# EAGLE board L4V2-5 (EAGLE 8.7.0)
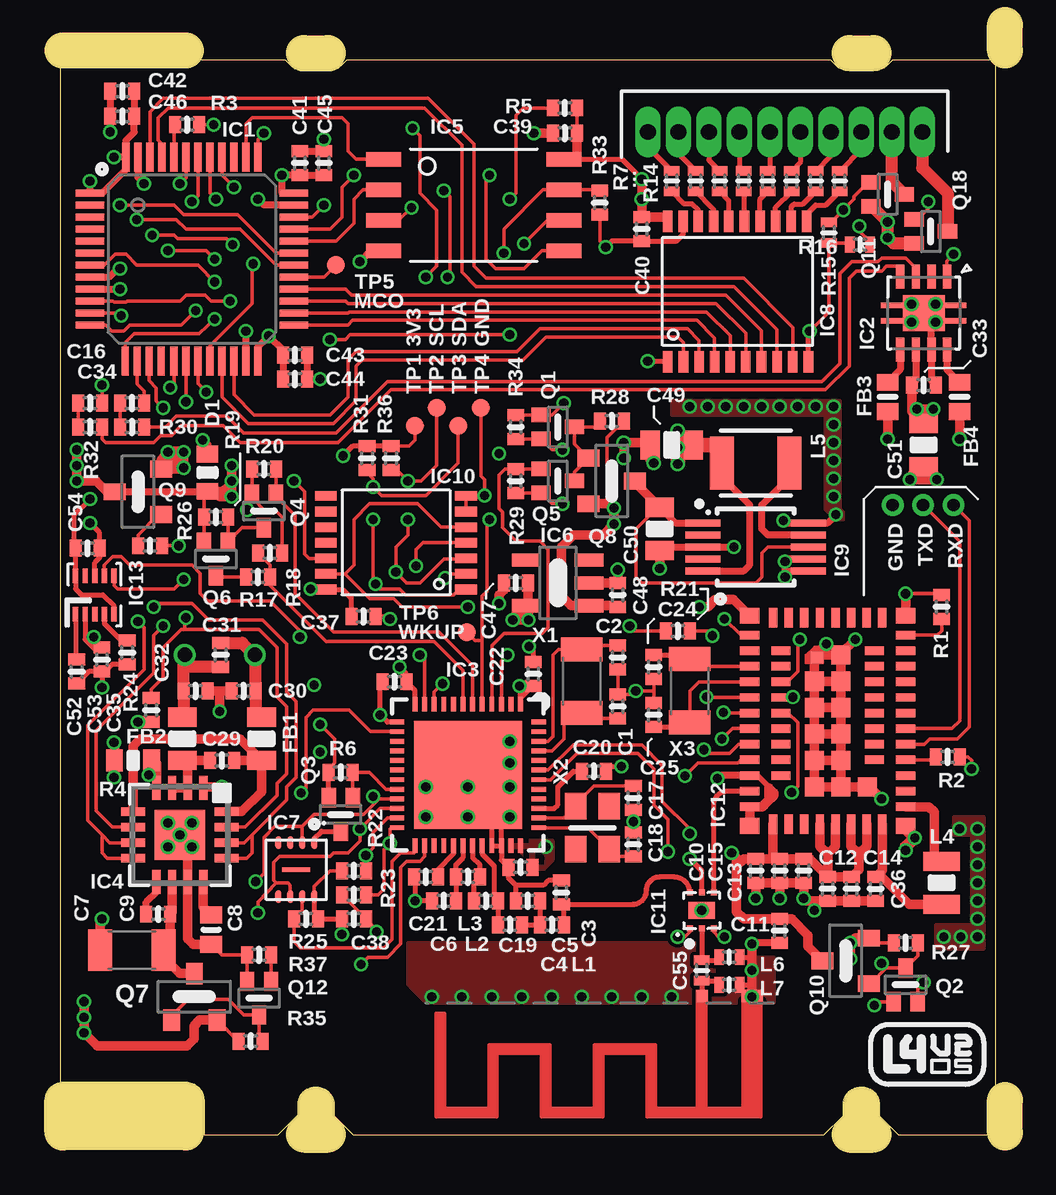
[diagram p4: board, top side]
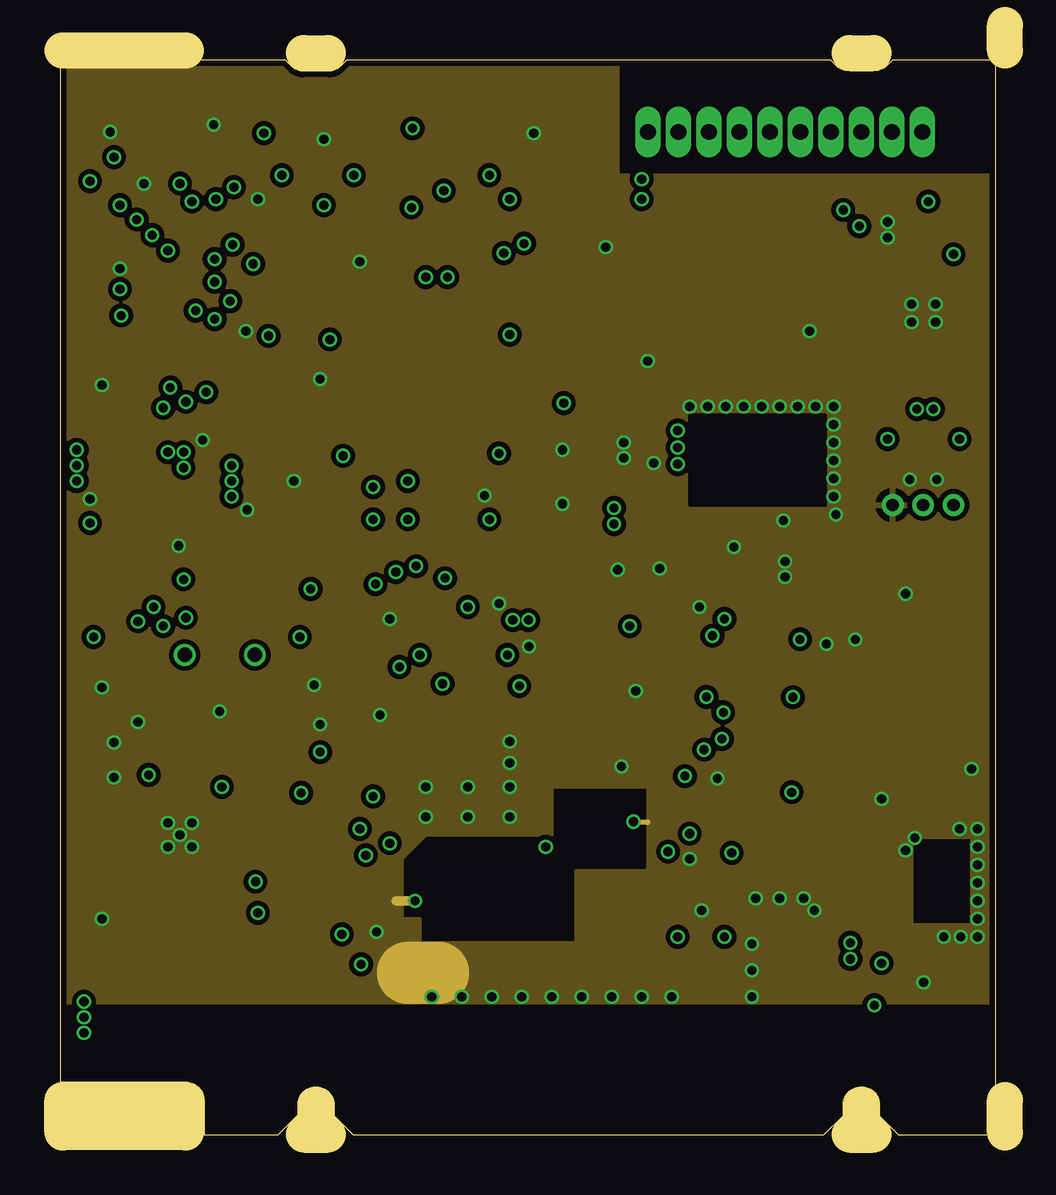
[diagram p5: board, inner layer GND]
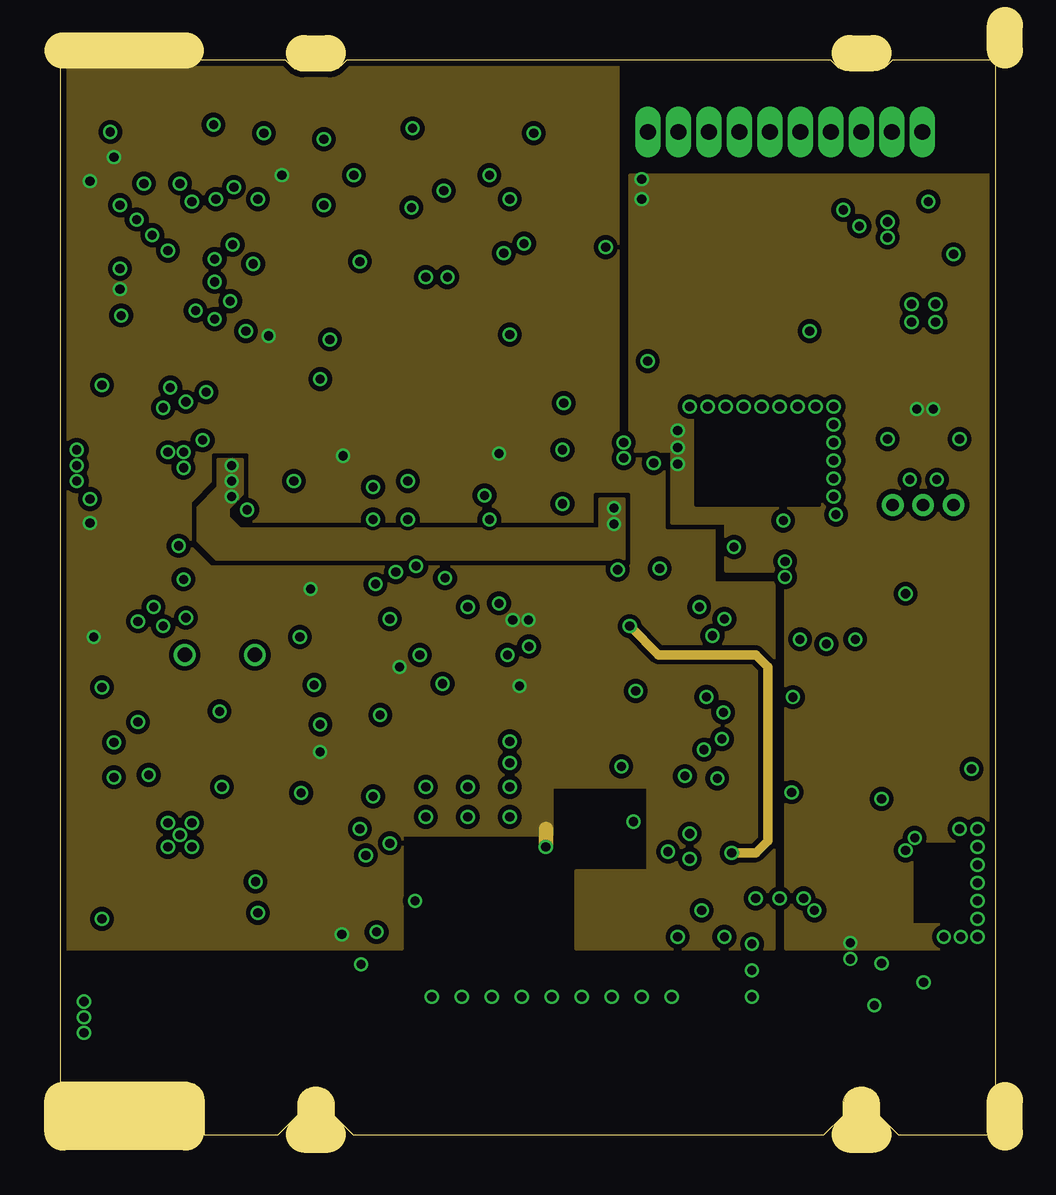
[diagram p6: board, inner layer Power]
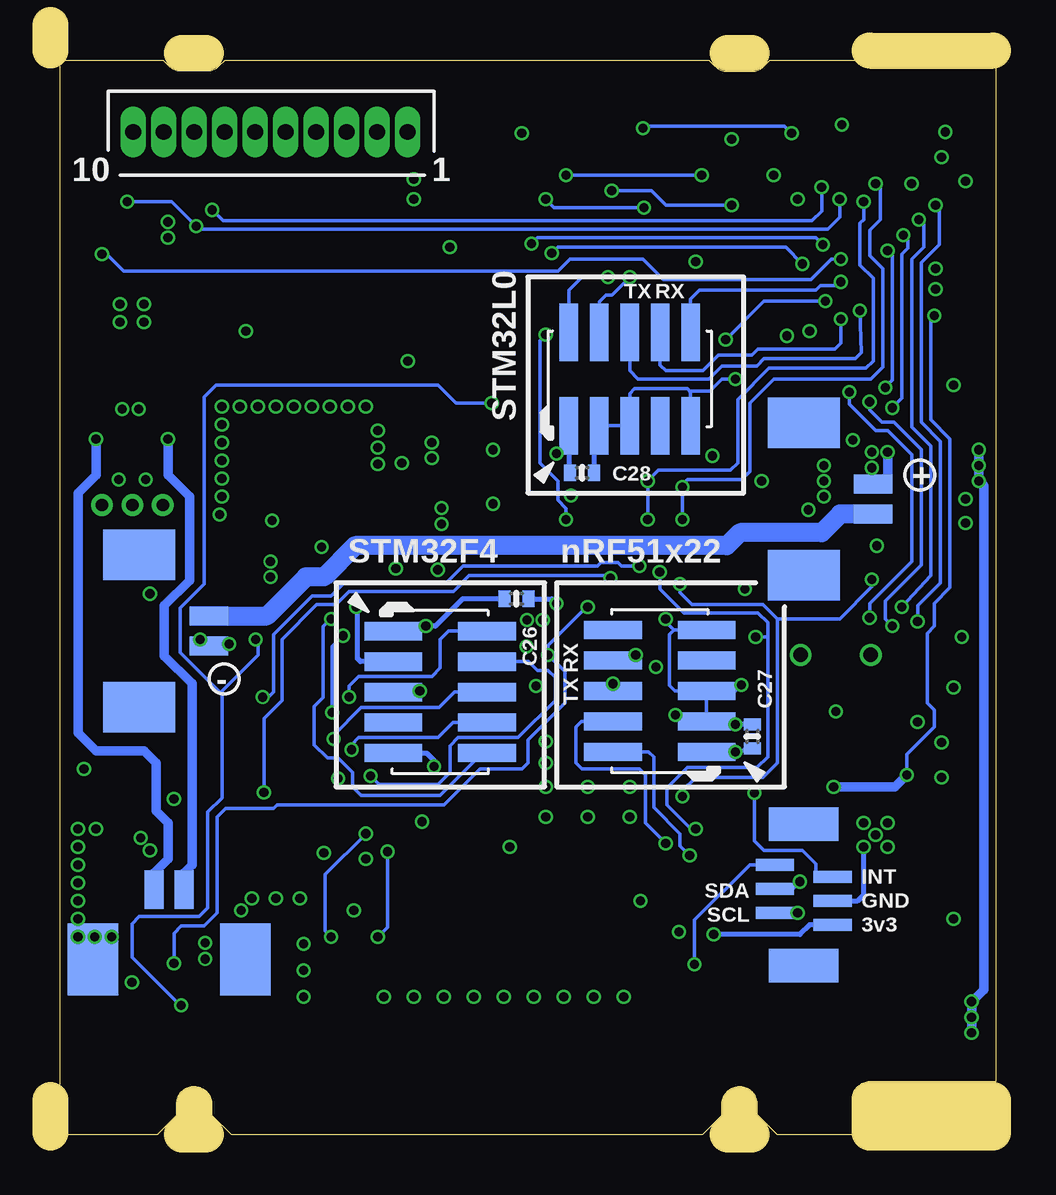
[diagram p7: board, bottom side, seen from below]

Size 39 x 44.8 mm. Coordinates in mm from the lower left corner, seen from the top.
Copper layers (1*2*15*16): Top 0.035mm / dielectric 0.2mm / GND 0.018mm / dielectric 1.2mm / Power 0.018mm / dielectric 0.2mm / Bottom 0.035mm
Design rules "default *": minimum track width 6mil, minimum drill 10mil, track to track 6mil, track to pad 6mil, pad to pad 6mil, via to via 8mil, smd to smd 0mil, copper to edge 10mil, drill to drill 10mil, minimum pad ring 6mil, minimum via ring 4mil, stop-mask expansion 4mil, vias tented up to drill 20mil, thermal gap 10mil

## Footprints (pad centres in the part's own frame; a part is rotated, then mirrored left to right if it is on the bottom)
ANTENNA-2.450GHZ-TI-AN043 = smd 0.5 x 0.5: ANT 0,0 | smd 0.9 x 0.5: RFGND -2.1,0
0402 = smd 0.5 x 0.7: 1 -0.5,0; 2 0.5,0
1206-MIN = smd 1 x 1.727: 1 -1.323,0; 2 1.323,0
0603-MIN = smd 0.7 x 0.9: 1 -0.61,0; 2 0.61,0
0805-MIN = smd 0.8 x 1.2: 1 -0.9,0; 2 0.9,0
0402-MIN = smd 0.4 x 0.65: 1 -0.425,0; 2 0.425,0
0603 = smd 0.7 x 0.9: 1 -0.777,0; 2 0.777,0
LQFP48-0.5MM = smd 1.2 x 0.297: 1 -4.25,2.75; 2 -4.25,2.25; 3 -4.25,1.75; 4 -4.25,1.25; 5 -4.25,0.75; 6 -4.25,0.25; 7 -4.25,-0.25; 8 -4.25,-0.75; 9 -4.25,-1.25; 10 -4.25,-1.75; 11 -4.25,-2.25; 12 -4.25,-2.75; 25 4.25,-2.75; 26 4.25,-2.25; 27 4.25,-1.75; 28 4.25,-1.25; 29 4.25,-0.75; 30 4.25,-0.25; 31 4.25,0.25; 32 4.25,0.75; 33 4.25,1.25; 34 4.25,1.75; 35 4.25,2.25; 36 4.25,2.75 | smd 0.297 x 1.2: 13 -2.78,-4.25; 14 -2.28,-4.25; 15 -1.78,-4.25; 16 -1.28,-4.25; 17 -0.75,-4.25; 18 -0.25,-4.25; 19 0.25,-4.25; 20 0.75,-4.25; 21 1.25,-4.25; 22 1.75,-4.25; 23 2.25,-4.25; 24 2.75,-4.25; 37 2.75,4.25; 38 2.25,4.25; 39 1.75,4.25; 40 1.25,4.25; 41 0.75,4.25; 42 0.25,4.25; 43 -0.25,4.25; 44 -0.75,4.25; 45 -1.25,4.25; 46 -1.75,4.25; 47 -2.25,4.25; 48 -2.75,4.25
QFN8-3X3MM-TI-TPA200X-BETTER-STENCIL = smd 0.35 x 1: 1 0.975,1.525; 2 0.325,1.525; 3 -0.325,1.525; 4 -0.975,1.525; 5 -0.975,-1.525; 6 -0.325,-1.525; 7 0.325,-1.525; 8 0.975,-1.525 | smd 1.75 x 1.5: BODY1 0,0 | smd 0.9 x 0.23: BODY2 -1.325,0.325; BODY3 -1.325,-0.325; BODY4 1.325,-0.325; BODY5 1.325,0.325
QFN48-5X5MM-0.4MM = smd 0.6 x 0.203: 1 -2.95,2.2; 2 -2.95,1.8; 3 -2.95,1.4; 4 -2.95,1; 5 -2.95,0.6; 6 -2.95,0.2; 7 -2.95,-0.2; 8 -2.95,-0.6; 9 -2.95,-1; 10 -2.95,-1.4; 11 -2.95,-1.8; 12 -2.95,-2.2; 25 2.95,-2.2; 26 2.95,-1.8; 27 2.95,-1.4; 28 2.95,-1; 29 2.95,-0.6; 30 2.95,-0.2; 31 2.95,0.2; 32 2.95,0.6; 33 2.95,1; 34 2.95,1.4; 35 2.95,1.8; 36 2.95,2.2 | smd 0.203 x 0.6: 13 -2.2,-2.95; 14 -1.8,-2.95; 15 -1.4,-2.95; 16 -1,-2.95; 17 -0.6,-2.95; 18 -0.2,-2.95; 19 0.2,-2.95; 20 0.6,-2.95; 21 1,-2.95; 22 1.4,-2.95; 23 1.8,-2.95; 24 2.2,-2.95; 37 2.2,2.95; 38 1.8,2.95; 39 1.4,2.95; 40 1,2.95; 41 0.6,2.95; 42 0.2,2.95; 43 -0.2,2.95; 44 -0.6,2.95; 45 -1,2.95; 46 -1.4,2.95; 47 -1.8,2.95; 48 -2.2,2.95 | smd 4.5 x 4.5: EP 0,0
QFN16-4X4MM-0.65MM = smd 1 x 0.35: 1 -1.95,0.975; 2 -1.95,0.325; 3 -1.95,-0.325; 4 -1.95,-0.975; 9 1.95,-0.975; 10 1.95,-0.325; 11 1.95,0.325; 12 1.95,0.975 | smd 0.35 x 1: 5 -0.975,-1.95; 6 -0.325,-1.95; 7 0.325,-1.95; 8 0.975,-1.95; 13 0.975,1.95; 14 0.325,1.95; 15 -0.325,1.95; 16 -0.975,1.95 | smd 2.1 x 2.1: PAD 0,0
SOIC8-5.3MM-MINIMAL = smd 1.473 x 0.61: 1 -3.763,1.905; 2 -3.763,0.635; 3 -3.763,-0.635; 4 -3.763,-1.905; 5 3.763,-1.905; 6 3.763,-0.635; 7 3.763,0.635; 8 3.763,1.905
SOT23-5 = smd 0.55 x 1.2: 1 0.95,1.3; 2 0,1.3; 3 -0.95,1.3; 4 -0.95,-1.3; 5 0.95,-1.3
DFN8-2.5MMX2.5MM = smd 0.525 x 0.25: 1 -1.125,0.75; 2 -1.125,0.25; 3 -1.125,-0.25; 4 -1.125,-0.75; 5 1.125,-0.75; 6 1.125,-0.25; 7 1.125,0.25; 8 1.125,0.75 | smd 0.2 x 1.2: P$9 0,0
TSSOP20 = smd 0.4 x 0.9: 1 2.91,2.925; 2 2.26,2.925; 3 1.61,2.925; 4 0.96,2.925; 5 0.31,2.925; 6 -0.34,2.925; 7 -0.99,2.925; 8 -1.64,2.925; 9 -2.297,2.925; 10 -2.947,2.925; 11 -2.88,-2.925; 12 -2.23,-2.925; 13 -1.58,-2.925; 14 -0.93,-2.925; 15 -0.28,-2.925; 16 0.37,-2.925; 17 1.005,-2.925; 18 1.64,-2.925; 19 2.275,-2.925; 20 2.91,-2.925
VSSOP10 = smd 0.3 x 1.45: 1 -1,-2.2; 2 -0.5,-2.2; 3 0,-2.2; 4 0.5,-2.2; 5 1,-2.2; 6 1,2.2; 7 0.5,2.2; 8 0,2.2; 9 -0.5,2.2; 10 -1,2.2
TSSOP14 = smd 0.4 x 0.9: 1 2.275,2.925; 2 1.625,2.925; 3 0.975,2.925; 4 0.325,2.925; 5 -0.325,2.925; 6 -0.975,2.925; 7 -1.625,2.925; 8 -1.625,-2.925; 9 -0.975,-2.925; 10 -0.325,-2.925; 11 0.325,-2.925; 12 0.975,-2.925; 13 1.625,-2.925; 14 2.275,-2.925
DFN6-1.5MMX1.5MM = smd 0.25 x 0.25: 1 -0.75,0.5; 2 -0.75,0; 3 -0.75,-0.5; 4 0.75,-0.5; 5 0.75,0; 6 0.75,0.5 | smd 0.7 x 1.1: P$1 0,0
MURATA-1BD = smd 0.65 x 0.8: 1 -4.375,-3.25; 14 4.375,-3.25; 23 4.375,3.25; 36 -4.375,3.25 | smd 0.35 x 0.8: 2 -3.575,-3.25; 3 -2.925,-3.25; 4 -2.275,-3.25; 5 -1.625,-3.25; 6 -0.975,-3.25; 7 -0.325,-3.25; 8 0.325,-3.25; 9 0.975,-3.25; 10 1.625,-3.25; 11 2.275,-3.25; 12 2.925,-3.25; 13 3.575,-3.25; 24 3.575,3.25; 25 2.925,3.25; 26 2.275,3.25; 27 1.625,3.25; 28 0.975,3.25; 29 0.325,3.25; 30 -0.325,3.25; 31 -0.975,3.25; 32 -1.625,3.25; 33 -2.275,3.25; 34 -2.925,3.25; 35 -3.575,3.25; 45 -2.925,-1.95; 46 -2.275,-1.95; 47 -1.625,-1.95; 48 -0.975,-1.95; 49 -0.325,-1.95; 50 0.325,-1.95; 51 0.975,-1.95; 52 1.625,-1.95; 53 2.275,-1.95; 54 1.625,1.95; 55 0.975,1.95; 56 0.325,1.95; 57 -0.325,1.95; 58 -0.975,1.95; 59 -1.625,1.95; 60 -2.275,1.95; 61 -2.925,1.95 | smd 0.8 x 0.35: 15 4.3,-2.275; 16 4.3,-1.625; 17 4.3,-0.975; 18 4.3,-0.325; 19 4.3,0.325; 20 4.3,0.975; 21 4.3,1.625; 22 4.3,2.275; 37 -4.3,2.275; 38 -4.3,1.625; 39 -4.3,0.975; 40 -4.3,0.325; 41 -4.3,-0.325; 42 -4.3,-0.975; 43 -4.3,-1.625; 44 -4.3,-2.275 | smd 0.5 x 0.5: 62 -2.65,-0.445 | smd 0.8 x 0.8: 63 -1.65,-0.55; 64 -0.55,-0.55; 65 0.55,-0.55; 66 1.65,-0.55; 67 2.75,-0.55; 68 2.75,0.55; 69 2.75,1.65; 70 -2.75,0.55; 71 -1.65,0.55; 72 -0.55,0.55; 73 0.55,0.55; 74 1.65,0.55
QFN10-2X2MM-FREESCALE-MAG3110 = smd 0.225 x 0.6: 1 0.8,0.8; 2 0.4,0.8; 3 0,0.8; 4 -0.4,0.8; 5 -0.8,0.8; 6 -0.8,-0.8; 7 -0.4,-0.8; 8 0,-0.8; 9 0.4,-0.8; 10 0.8,-0.8
HEADER-FFC-6-OMRON-XF2J-CCW = smd 0.5 x 1.6: 1 -1.25,-1.2; 2 -0.75,1.2; 3 -0.25,-1.2; 4 0.25,1.2; 5 0.75,-1.2; 6 1.25,1.2 | smd 1.4 x 2.9: ANCHOR@1 -2.95,0; ANCHOR@2 2.95,0
HEADER-1X03-0.05IN-NO-SILK = drill 0.508 pad 0.914: 1 0,0; 2 1.27,0; 3 2.54,0
HEADER-1X10-1.27MM = drill 0.66 pad 1.067 long: 1 -5.715,0; 2 -4.445,0; 3 -3.175,0; 4 -1.905,0; 5 -0.635,0; 6 0.635,0; 7 1.905,0; 8 3.175,0; 9 4.445,0; 10 5.715,0
HEADER-JST-2-MOLEX-53261-0271 = smd 0.8 x 1.6: 1 0.625,2.9; 2 -0.625,2.9 | smd 2.1 x 3: ANCHOR@1 3.175,0; ANCHOR@2 -3.175,0
HEADER-1X01-0.6MM-DIAM = drill 0.6: P$1 0,0
HEADER-SMT-1.27MM-5X2-JTAG = smd 0.76 x 2.4: 1 -2.54,-1.95; 2 -2.54,1.95; 3 -1.27,-1.95; 4 -1.27,1.95; 5 0,-1.95; 6 0,1.95; 7 1.27,-1.95; 8 1.27,1.95; 9 2.54,-1.95; 10 2.54,1.95
0805-WIDE = smd 0.8 x 1.524: 1 -0.9,0; 2 0.9,0
1210-INDUCTOR-MIN = smd 1 x 2.2: 1 -1.4,0; 2 1.4,0
SC-75A = smd 0.6 x 0.8: 1 0.5,0.7; 2 -0.5,0.7; 3 0,-0.7
SOT23-3 = smd 0.7 x 0.9: 1 0.95,0.97; 2 -0.95,0.97; 3 0,-0.97
TEST-POINT-0.75MM = smd 0.75 x 0.75: 1 0,0
CRYSTAL-NDK-NX2025SA-2X2.5MM = smd 1.1 x 0.9: 1 -0.9,-0.7; 2 0.9,-0.7; 3 0.9,0.7; 4 -0.9,0.7

## Placement (x,y rotation side)
ANT1  ANTENNA-WITH-GND-2.450GHZ-TI-AN043  [ANTENNA-2.450GHZ-TI-AN043]  26.75,5.78 180 top
C1  12pF  [0402]  23.25,17.85 270 top
C2  12pF  [0402]  23.25,19.9 90 top
C3  1.2pF  [0402]  20.9,10.1 90 top
C4  2.2pF  [0402]  18.75,8.75 0 top
C5  1.5pF  [0402]  19.5,9.75 180 top
C6  2.2nF  [0402]  16,9.75 180 top
C7  47uF  [1206-MIN]  3,7.7 0 top
C8  2.2uF  [0603-MIN]  6.3,8.55 90 top
C9  10nF  [0402]  4.1,9.2 180 top
C10  100nF  [0402]  29,11 270 top
C11  4.7uF  [0402]  30,8.5 270 top
C12  100nF  [0402]  32,10.25 270 top
C13  4.7uF  [0402]  31,11 270 top
C14  4.7uF  [0402]  33,10.25 270 top
C15  100nF  [0402]  30,11 270 top
C16  1uF  [0402]  1.25,30.5 0 top
C17  12pF  [0402]  23.9,14.05 90 top
C18  12pF  [0402]  23.9,12.1 270 top
C19  1nF  [0402]  19.2,11.15 180 top
C20  100nF  [0402]  22.25,15.15 0 top
C21  47nF  [0402]  15.25,10.75 180 top
C22  100nF  [0402]  19.73,19.2 270 top
C23  100nF  [0402]  13.95,18.88 0 top
C24  12pF  [0402]  24.75,19.5 90 top
C25  12pF  [0402]  24.75,17.5 270 top
C26  100nF  [0402]  19.97,22.34 180 bottom
C27  100nF  [0402]  10.14,16.6 270 bottom
C28  100nF  [0402]  17.23,27.59 180 bottom
C29  10nF  [0402]  6.75,15.6 180 top
C30  1nF  [0402]  7.65,18.5 0 top
C31  1nF  [0402]  6.7,20 270 top
C32  1nF  [0402]  5.65,18.5 0 top
C33  100nF  [0402]  36,31.25 180 top
C34  1uF  [0402]  3,30.5 180 top
C35  100nF  [0402]  2.8,20.1 90 top
C36  4.7uF  [0402]  34,10.25 90 top
C37  100nF  [0402]  12.65,21.6 0 top
C38  100nF  [0402]  12.25,9 180 top
C39  100nF  [0402]  21.05,41.75 0 top
C40  100nF  [0402]  24.25,37.75 270 top
C41  1uF  [0402]  10,40.5 270 top
C42  1uF  [0402]  2.6,43.5 0 top
C43  1uF  [0402]  9.8,32.5 180 top
C44  100nF  [0402]  9.8,31.5 180 top
C45  100nF  [0402]  11,40.5 270 top
C46  100nF  [0402]  2.6,42.45 0 top
C47  2.2uF  [0402]  19,23 180 top
C48  1uF  [0402]  23.25,22.5 90 top
C49  22uF  [0805-MIN]  25.5,28.75 180 top
C50  10uF  [0805-MIN]  25,25.25 270 top
C51  22uF  [0805-MIN]  36,28.75 270 top
C52  100nF  [0402]  0.7,19.3 90 top
C53  100nF  [0402]  1.75,19.8 90 top
C54  100nF  [0402]  1.15,24.45 180 top
C55  2.2pF  [0402-MIN]  26.75,6.85 90 top
D1  DIODE-TVS-0603  [0603]  6.15,27.6 270 top
FB1  FERRITE-0805  [0805-MIN]  8.4,16.5 90 top
FB2  FERRITE-0805  [0805-MIN]  5.1,16.5 90 top
FB3  FERRITE-0603  [0603-MIN]  34.5,30.75 270 top
FB4  FERRITE-0603  [0603-MIN]  37.5,30.75 270 top
IC1  ST-STM32L15X-48PIN-LQFP48  [LQFP48-0.5MM]  5.5,36.5 0 top
IC2  AMP-AUDIO-CLASS-D-TI-TPA2006A-BETTER-STENCIL  [QFN8-3X3MM-TI-TPA200X-BETTER-STENCIL]  36,34.25 0 top
IC3  BLUETOOTH-4.0-SOC-NORDIC-NRF51822-QFN48  [QFN48-5X5MM-0.4MM]  17,15 270 top
IC4  MOTOR-DRIVER-TI-DRV8833  [QFN16-4X4MM-0.65MM]  5,12.5 270 top
IC5  FLASH-SPI-DUAL-QUAD-SOIC-5.3MM  [SOIC8-5.3MM-MINIMAL]  17.25,38.75 0 top
IC6  LDO-REGULATOR-FIXED-WITH-ENABLE-TI-TPS709XX  [SOT23-5]  20.75,23 270 top
IC7  APPLE-MFI-2.0C  [DFN8-2.5MMX2.5MM]  9.85,11.05 270 top
IC8  BUFFER-OCTAL-FAIRCHILD-74AC541TSSOP20  [TSSOP20]  28.25,35.15 180 top
IC9  SWITCHING-REGULATOR-VARIABLE-BUCK-TI-TPS62056  [VSSOP10]  29,24.5 270 top
IC10  QUAD-ANALOG-SWITCH-4066-MM74HC4066-TSSOP  [TSSOP14]  14,25 270 top
IC11  SPDT-SKY13370  [DFN6-1.5MMX1.5MM]  26.75,9.35 90 top
IC12  MURATA-1BD  [MURATA-1BD]  32,17.25 270 top
IC13  MAGNETOMETER-FREESCALE-MAG3110  [QFN10-2X2MM-FREESCALE-MAG3110]  1.45,22.5 180 top
K1  HEADER-1X06-NO-SILK-FFC-6-OMRON-XF2J-CCW  [HEADER-FFC-6-OMRON-XF2J-CCW]  8,10 90 bottom
K2  HEADER-1X03-NO-SILK-0.05IN-NO-SILK  [HEADER-1X03-0.05IN-NO-SILK]  37.25,26.25 180 top
K3  HEADER-1X10-NO-SILK-1.27MM  [HEADER-1X10-1.27MM]  30.23,41.8 0 top
K6  HEADER-1X02-JST-2-MOLEX  [HEADER-JST-2-MOLEX-53261-0271]  35.7,21 270 bottom
K7  HEADER-1X02-JST-2-MOLEX  [HEADER-JST-2-MOLEX-53261-0271]  8,26.5 270 bottom
K8  HEADER-1X01-0.6MM  [HEADER-1X01-0.6MM-DIAM]  8.12,20 0 top
K9  HEADER-1X01-0.6MM  [HEADER-1X01-0.6MM-DIAM]  5.2,20 0 top
K10  HEADER-1X02-JST-2-MOLEX  [HEADER-JST-2-MOLEX-53261-0271]  34.45,7.31 0 bottom
K11  HEADER-ARM-JTAG-2X5-1.27MM  [HEADER-SMT-1.27MM-5X2-JTAG]  15.25,31.5 0 bottom
K12  HEADER-ARM-JTAG-2X5-1.27MM  [HEADER-SMT-1.27MM-5X2-JTAG]  23.15,18.45 270 bottom
K13  HEADER-ARM-JTAG-2X5-1.27MM  [HEADER-SMT-1.27MM-5X2-JTAG]  14,18.5 90 bottom
L1  3.3nH  [0402]  20.5,8.75 0 top
L2  4.7nH  [0402]  17.75,9.75 0 top
L3  10nH  [0402]  17,10.75 0 top
L4  1.5uH  [0805-WIDE]  36.75,10.5 270 top
L5  10uH  [1210-INDUCTOR-MIN]  29,28 180 top
L6  $DNP  [0402-MIN]  27.9,7.4 180 top
L7  $DNP  [0402-MIN]  27.9,6.25 180 top
Q1  MOSFET-N-CHANNEL-VISHAY-SI1032R  [SC-75A]  20.75,29.5 90 top
Q2  MOSFET-N-CHANNEL-VISHAY-SI1032R  [SC-75A]  35.25,6.25 180 top
Q3  MOSFET-N-CHANNEL-VISHAY-SI1032R  [SC-75A]  11.7,13.35 0 top
Q4  MOSFET-N-CHANNEL-VISHAY-SI1032R  [SC-75A]  8.5,26 0 top
Q5  MOSFET-N-CHANNEL-VISHAY-SI1032R  [SC-75A]  20.75,27.25 90 top
Q6  MOSFET-P-CHANNEL-DIODES-DMG1013T  [SC-75A]  6.5,24 0 top
Q7  MOSFET-P-CHANNEL-VISHAY-SI2301  [SOT23-3]  5.6,5.75 180 top
Q8  MOSFET-P-CHANNEL-VISHAY-SI2301  [SOT23-3]  23,27.25 90 top
Q9  MOSFET-P-CHANNEL-VISHAY-SI2301  [SOT23-3]  3.25,26.8 270 top
Q10  MOSFET-P-CHANNEL-VISHAY-SI2301  [SOT23-3]  32.75,7.25 270 top
Q11  MOSFET-N-CHANNEL-VISHAY-SI1032R  [SC-75A]  34.5,39.2 90 top
Q12  MOSFET-N-CHANNEL-VISHAY-SI1032R  [SC-75A]  8.3,5.7 0 top
Q18  MOSFET-N-CHANNEL-VISHAY-SI1032R  [SC-75A]  36.3,37.65 90 top
R1  10k  [0402]  36.75,22 270 top
R2  10k  [0402]  37,15.75 180 top
R3  10k  [0402]  5.3,42.1 0 top
R4  100m  [0603]  3.05,15.6 180 top
R5  10k  [0402]  21.05,42.8 180 top
R6  10k  [0402]  11.7,15.1 0 top
R7  100  [0402-MIN]  25.5,39.75 270 top
R8  100  [0402-MIN]  26.5,39.75 270 top
R9  100  [0402-MIN]  27.5,39.75 270 top
R10  100  [0402-MIN]  28.5,39.75 270 top
R11  100  [0402-MIN]  29.5,39.75 270 top
R12  100  [0402-MIN]  30.5,39.75 270 top
R13  100  [0402-MIN]  31.5,39.75 270 top
R14  100  [0402-MIN]  32.5,39.75 270 top
R15  10k  [0402-MIN]  32.05,37.6 90 top
R16  10k  [0402-MIN]  33.35,37.1 0 top
R17  10k  [0402]  8.25,23.25 180 top
R18  10k  [0402]  8.75,24.25 180 top
R19  10k  [0402]  6.5,25.75 180 top
R20  10k  [0402]  8.5,27.75 0 top
R21  10k  [0402]  25.75,21 0 top
R22  10k  [0402]  12.25,11 180 top
R23  10k  [0402]  12.25,10 180 top
R24  10k  [0402]  3.8,17.7 90 top
R25  10k  [0402]  10.25,9 0 top
R26  100k  [0402]  3.75,24.55 180 top
R27  10k  [0402]  35.25,8 180 top
R28  10k  [0402]  23,29.75 0 top
R29  10k  [0402]  19,27.25 90 top
R30  150k  [0402]  3,29.5 0 top
R31  4.7k  [0402]  12.8,28.2 90 top
R32  150k  [0402]  1.25,29.5 0 top
R33  10k  [0402]  22.5,38.85 270 top
R34  10k  [0402]  19,29.5 90 top
R35  10k  [0402]  7.95,3.9 180 top
R36  4.7k  [0402]  13.8,28.2 90 top
R37  10k  [0402]  8.3,7.5 0 top
TP1  $DNP  [TEST-POINT-0.75MM]  14.8,29.55 90 top
TP2  $DNP  [TEST-POINT-0.75MM]  15.7,30.3 90 top
TP3  $DNP  [TEST-POINT-0.75MM]  16.6,29.55 90 top
TP4  $DNP  [TEST-POINT-0.75MM]  17.55,30.3 90 top
TP5  $DNP  [TEST-POINT-0.75MM]  11.5,36.25 0 top
TP6  $DNP  [TEST-POINT-0.75MM]  16.95,20.95 0 top
U$34  [MECH-OUTLINE]  0,0 0 top
X1  CRYSTAL-ABS07  [1206-MIN]  21.75,18.9 90 top
X2  CRYSTAL-4-PIN-NDK-NX2520SA-2X2.5MM  [CRYSTAL-NDK-NX2025SA-2X2.5MM]  22.2,12.8 90 top
X3  CRYSTAL-ABS07  [1206-MIN]  26.25,18.5 270 top

## Tracks (layer width: path | path; a pad name or v marks a point on that pad's centre or on a via)
16MHZ-XTAL-IN
  Top 0.152: IC3.37 22,12.8 X2.1 22.9,11.6 C18.2
16MHZ-XTAL-OUT
  Top 0.152: IC3.38 21,13.2 X2.3 21.5,13.8 22.25,14.55 C17.2
32KHZ-XTAL-IN-BLE
  Top 0.152: IC3.46 20.35,16.4 20.55,16.6 20.55,20 20.77,20.22 X1.2 21.93,20.4 C2.2
32KHZ-XTAL-IN-WIFI
  Top 0.152: IC12.5 26.62,18.88 26.25,18.5 X3.2
  Top 0.203: C25.2 26.07,17 X3.2
32KHZ-XTAL-OUT-BLE
  Top 0.152: C1.2 21.83,17.35 X1.1 21,17.58 21,16.5 20.5,16 IC3.45
32KHZ-XTAL-OUT-WIFI
  Top 0.152: IC12.4 26.55,19.52 X3.1
  Top 0.203: C24.2 26.07,20 X3.1
!(SMPS-EN)
  Top 0.152: Q5.3 21.45,27.62 Q8.1 21.45,28.78 Q1.3 22.25,29.5 R28.1
!(VMOTOR-EN)
  Top 0.152: Q7.1 4.65,4.95 5.35,5.65 7,5.65 7.65,5 Q12.3 8.3,4.05 R35.1
!FLASH-SPI-CS
  Top 0.152: IC5.1 12.35,40.66 12,41 12,42.15 11.75,42.4 8,42.4 7.75,42.15 IC1.38
!MOTOR-FAULT  (via drill 0.38)
  Top 0.152: IC4.6 2.17,12.82 1.5,13.5 1.5,16.85 3.9,19.25 3.9,20.8 v4.3,21.2 | IC1.18 v5.25,30.55
  Bottom 0.152: v4.3,21.2 4.6,21.5 4.6,22.25 3.1,23.75 3.1,28.55 4.25,29.7 4.75,29.7 5.25,30.2 v5.25,30.55
!WIFI-POWER  (via drill 0.38)
  Top 0.152: R27.1 35.75,7.45 Q2.3 34.45,6.95 | Q10.1 33.8,6.3 34.45,6.95 | IC3.3 18.4,19.75 v18.65,20 | IC10.5 15.88,25.32 14.9,26.3 12.9,26.3 12.25,25.65 12.25,23.75 11.88,23.38 | IC10.13 11.88,23.38 | v17,22 14.25,22 13.9,22.35 12.9,22.35 11.88,23.38 | v34.25,7.15 34.45,6.95
  Bottom 0.152: v17,22 17.05,22 18.65,20.4 v18.65,20 17.95,19.3 17.95,18 19.5,16.45 19.5,15.5 19.75,15.25 21.5,15.25 23,13.75 29.95,13.75 30.1,13.6 32.1,13.6 32.45,13.25 32.45,9.25 33,8.7 33.95,8.7 34.25,8.4 v34.25,7.15
ANT-BLE
  Top 0.203: L1.2 21,9.5 C3.1 23.85,9.6 arc90 24.45,10.2 arc-90 25,10.75 25.6,10.75 arc-90 IC11.6
ANT-BLE-CTL  (via drill 0.38)
  Top 0.152: IC3.42 20.45,14.8 21.55,15.9 24.1,15.9 24.75,15.25 24.75,13.75 25.35,13.15 v25.35,11.8 | v25.75,8.25 26.05,8.25 26.25,8.45 IC11.1
  Bottom 0.152: v25.35,11.8 25.35,8.65 v25.75,8.25
ANT-WIFI
  Top 0.203: IC11.4 27.25,13.75 arc-90 27.82,14.32 IC12.12
ANT-WIFI-CTL  (via drill 0.38)
  Top 0.152: IC3.43 20.35,15.2 21.4,16.25 24.25,16.25 25.1,15.4 25.1,13.9 26.25,12.75 v26.25,12.55 | v27.7,8.25 27.45,8.25 27.25,8.45 IC11.3
  Bottom 0.152: v27.7,8.25 27.95,8.5 27.95,10.85 v26.25,12.55
AUDIO-EN  (via drill 0.38)
  Top 0.152: IC1.17 4.75,31.3 v4.6,31.15 | v4.5,36.85 6.1,36.85 v6.45,36.5 | IC2.1 36.98,36.42 v37.25,36.7
  Bottom 0.152: v6.45,36.5 6.85,36.5 7.7,35.65 13.85,35.65 14.7,36.5 17.75,36.5 18.25,36 36.35,36 37.05,36.7 v37.25,36.7 | v4.6,31.15 4.3,31.45 4.3,36.65 v4.5,36.85
BATT-MEAS
  Top 0.152: R18.2 8.75,23.75 R17.1 8.75,22.9 11.1,20.55 15.6,20.55 16.8,19.35 IC3.7
BATT-MEAS-EN
  Top 0.152: R20.2 Q4.1 9,26.6 9.8,25.8 9.8,22.55 11.4,20.95 15.8,20.95 17.2,19.55 IC3.6
BOOT0_COP
  Top 0.152: R3.1 4.75,42.1 IC1.44
COP-WAKEUP  (via drill 0.38)
  Top 0.152: IC1.10 2.2,34.75 2.25,34.7 2.75,34.7 2.8,34.75 5,34.75 5.25,35 6.05,35 6.3,34.75 v7.1,34.75 | v11.25,33.15 11.9,33.15 12.1,33.35 v18.75,33.35 | v17.9,25.65 17.8,25.55 17.8,22.65 17.6,22.45 17.6,20.6 | IC3.5 17.6,20.6 | TP6.1 17.3,20.6 17.6,20.6
  Bottom 0.152: v7.1,34.75 9.65,34.75 v11.25,33.15 | v18.75,33.35 19,33.1 19,28 18.25,27.25 18.25,26.45 17.9,26.1 v17.9,25.65
DAC-AUDIO
  Top 0.152: IC1.14 3.22,31.28 3.5,31 C34.1
FFC-SPARE  (via drill 0.38)
  Top 0.152: IC3.26 15.2,11.6 15,11.4 14.45,11.4 14.2,11.15 14.2,7.95 13.65,7.4 12.85,7.4 v12.55,7.1
  Bottom 0.152: v12.55,7.1 12.55,8.95 10.25,11.25 K1.6
FLASH-RST  (via drill 0.38)
  Top 0.152: R33.1 22.46,39.38 IC5.7 20.14,39.38 18.5,37.75 v18.5,36.75 | IC1.20 6.25,32.9 8,34.65 8,36.25 v8.05,36.3
  Bottom 0.152: v8.05,36.3 8.75,37 18.25,37 v18.5,36.75
FLASH-SPI-MISO
  Top 0.152: IC5.2 12.63,39.38 12.25,39 12.25,38 11.5,37.25 IC1.32
FLASH-SPI-MOSI  (via drill 0.38)
  Top 0.152: IC1.33 11.25,37.75 11.75,38.25 11.75,39.5 v12.25,40 | IC5.5 20.1,36.85 19.34,36.09 18.16,36.09 17.75,36.5 17.75,39.85 v17.9,40
  Bottom 0.152: v17.9,40 v12.25,40
FLASH-SPI-SCK  (via drill 0.38)
  Top 0.152: v19.35,37.15 20.32,38.12 IC5.6 | v4.3,30.3 4.02,30.58 4.02,31.13 3.72,31.43 IC1.15 | v3.85,37.5 4.75,37.5 4.9,37.35 6.95,37.35 v7.2,37.1
  Bottom 0.152: v7.2,37.1 7.5,37.4 19.1,37.4 v19.35,37.15 | v4.3,30.3 3.9,30.7 3.9,36.7 3.65,36.95 3.65,37.3 v3.85,37.5
GND  (via drill 0.38)
  Top 0.152: R3.2 v6.4,42.1 | R33.2 22.5,37.25 v22.75,37 | C16.2 v1.75,31.25 | R20.1 Q4.2 | R18.1 9.25,25.75 9,26 8.55,26 8,26.55 Q4.2 | R23.2 C38.1 13.2,8.55 v13.2,8.45 | R24.1 v3.25,17.2 | Q2.2 35.75,6.1 v36,6.35 | C24.1 24.75,18.5 | 24.75,18.5 C25.1 | v35.25,22.55 36.75,22.55 R1.1 | R2.1 37.85,15.75 38,15.6 v38,15.25 | C17.1 v23.9,13.05 C18.1 | 23.4,19.4 C2.1 C1.1 23.85,18.35 v24,18.5 24.75,18.5 | v20.95,28.55 20.5,28.55 Q1.2 R34.1 | v20.95,26.3 20.5,26.3 Q5.2 R29.1 | IC3.EP v17,14.5 | 18.4,12.9 v18.75,13.25 | IC10.7 IC10.6 | IC10.12 10.38,24.02 10.2,24.2 10.2,26.8 v9.75,27.25 | v17.7,26.65 17.7,27.3 17.55,27.45 TP4.1 | R26.1 v4.95,24.55 | Q4.2 7.8,26.5 v7.8,26.05 | Q12.2 R37.1 6.74,7.5 C8.1 | 11.3,15.1 11.3,15.35 11.45,15.5 11.45,16.5 v10.85,17.1 | v31.25,33.5 32.05,34.3 R15.1 32.9,37.17 R16.1
  Top 0.2: IC12.11 29.07,14.97 29.45,14.6 29.45,13.85
  Top 0.203: IC8.19 25.98,37.52 25.7,37.25 C40.2 23,37.25 v22.75,37 | IC8.10 31.2,33.45 v31.25,33.5 | IC8.1 24.52,32.23 v24.5,32.25 | IC3.34 18.4,11.45 C19.2 18.7,10.7 19,10.4 | IC3.34 IC3.33 18,13 | C5.2 19,10.4 | C3.2 20.35,10.6 20.15,10.4 19,10.4 | Q3.2 R6.1 11.3,15.1 | IC3.34 18.4,12.9 | C20.2 22.75,15.35 v23.4,15.35 | IC3.13 13.65,17.2 v13.35,17.5 13.35,18.79 C23.1 | C21.2 14.8,10.7 v14.8,9.75 C6.2 | 19.7,20.2 v19.55,20.35 19.73,20.17 C22.1 | C37.2 13.65,21.6 v13.75,21.5 | IC10.7 17.68,26.62 v17.7,26.65 | IC13.5 2.25,22.05 1.8,22.5 0.9,22.5 0.65,22.75 IC13.10 C54.2 0.6,24.57 0.6,25.85 v1.25,26.5 | L7.1 28.85,6.25 | L6.1 28.85,7.4 | IC11.5 26.75,11 v26.25,11.5 | C53.1 1.2,19.3 C52.1 | C35.1 2.15,19.6 1.85,19.3 C53.1 | C53.1 v1.75,18.65
  Top 0.3: v28.1,24.5 IC9.3 25.15,24.5 | IC9.7 30.33,24 v30.23,23.9 v30.23,23.25 30.48,23.5 IC9.6 | v30.15,25.6 30.25,25.5 IC9.10 32,25.5 32.25,25.75 | C33.1 36.33,31.43 IC2.7 36.33,33.7 v36.5,33.87 36.38,33.87 IC2.BODY1 | IC1.23 v7.75,33.5 | v10.85,31.5 C44.1 C43.1 | IC1.8 2.05,35.75 2.4,36.1 v2.5,36.1 | IC5.4 12.96,36.84 v12.5,36.4 | IC1.35 8.5,38.75 v8.25,39 | IC12.11 27.52,14.97 v27.4,14.85 | C11.2 28.9,8 v28.85,7.95 | IC1.47 3.25,39.9 v3.5,39.65 | v2.1,41.8 C46.1 C42.1 | C41.1 C45.1 v11,41.5 | D1.1 6.17,28.78 v5.95,28.95
  Top 0.4: C15.2 C10.2 v29,9.85 | C15.2 C13.2 v31,9.85 31.1,9.75 31.45,9.75 | C14.2 C12.2 31.45,9.75 | C14.2 C36.1 | C14.2 33.25,9.75 | v30,9.85 C15.2 | C39.1 v19.75,41.75 | v2.25,16.35 2.27,16.33 R4.2 2.27,14.92 v2.25,14.9 | C8.1 5.56,7.94 5.33,8.18 IC4.11 5.33,11.93 5.4,12 v5.5,12 | v24.75,28 24.6,28.15 C49.2 24.49,28.85 v23.5,28.85 v23.5,28.2 | IC6.2 C48.2 v23.25,23.55 | C50.2 v25,23.6 | C47.2 18.5,22.7 18.3,22.5 v18.3,22.15 | IC12.62 31.45,19.8 IC12.63 | IC12.64 IC12.63 | IC12.72 IC12.71 IC12.70 32.55,20.05 v33.15,20.65 | IC12.64 IC12.65 | IC12.72 IC12.73 IC12.74 | IC12.66 IC12.65 | IC12.66 IC12.67 IC12.69 33.75,14.5 v34.25,14 | IC12.68 IC12.74 | IC12.66 IC12.74 | IC12.65 32.5,16.7 | IC12.64 IC12.72 | IC12.63 32.6,18.9 | IC12.62 31.66,20 32.5,20 | IC12.36 v35.25,22.55 | IC12.14 IC12.13 29.27,13.68 29.45,13.85 29.75,14.15 29.75,14.25 29.55,14.45 | IC12.62 31.55,20.05 v31.95,20.45 | 36,27.31 v35.42,27.31 35.75,28 36,28 C51.2 36,27.31 | 36,27.31 v36.55,27.31 36.25,28 | ANT1.RFGND 28.85,6.25 28.85,7.4 v28.85,7.95 | C7.1 1.68,8.93 v1.75,9 | 31.45,9.75 v31.45,9.35 | IC12.1 28.07,22.3 27.3,22.3 27,22 v26.65,22 | C32.2 6.65,18.5 | 6.65,18.5 C30.1 | 6.65,18.5 v6.65,17.65
  Top 0.5: IC12.23 35.25,12.76 v35.63,12.38 | v35.25,11.85 35.25,12 v35.63,12.38 | Q11.2 33.85,38.7 v34.5,38.05 v34.5,37.4 34.75,37.15 Q18.2
  GND 0.203: v23.9,13.05 24.5,13.05 24.5,13
  GND 0.4: v14.8,9.75 14,9.75
  GND 2.6: 14.5,6.75 15.75,6.75
  Bottom 0.152: v10.85,31.5 11.4,31.5 11.9,31 12.71,31 12.71,30.96 | 12.71,30.96 K11.9 | 12.71,30.96 12.85,31.1 15.05,31.1 15.25,30.9 K11.5 K11.3 16.73,29.34 | K13.3 K13.5 | K13.5 13.37,18.5 13.6,18.73 13.6,20.86 13.41,21.04 | K13.9 13.41,21.04 | K13.5 10.85,18.5 v10.6,18.75 | K12.5 24.05,18.45 v24,18.5 | 13.41,21.04 13.75,21.38 v13.75,21.5
  Bottom 0.2: C26.1 18.49,22.34 v18.3,22.15
  Bottom 0.203: K12.9 23.71,15.91 23.4,15.6 v23.4,15.35 | v13.35,17.5 13.1,17.25 12,17.25 | 16.73,29.34 C28.1 | K12.3 26.47,19.72 26.6,19.85 26.6,21.95 v26.65,22 | C27.1 v10.85,17.1 11.92,17.1 K13.3 | K1.3 5.75,9.75 5.5,10 v5.5,12
  Bottom 0.4: v31.95,20.45 32.73,20.45 K6.1
  other vias: 38.25,12 38.25,12.75 37.5,12.75 38.25,11.25 37.55,8.25 38.25,9 38.25,9.75 38.25,10.5 38.25,8.25 36.85,8.25 26.25,30.35 27,30.35 27.75,30.35 28.5,30.35 29.25,30.35 30,30.35 30.75,30.35 31.5,30.35 32.25,30.35 32.25,29.6 32.25,28.85 32.25,28.1 32.25,27.35 32.25,26.6 32.35,25.85 35.5,34.63 35.5,33.87 36.5,34.63 4.5,13 4.5,12 5,12.5 5.5,13 15.25,13.25 17,13.25 15.25,14.5 18.75,14.5 18.75,15.5 18.75,16.4 15.5,5.75 16.75,5.75 18,5.75 19.25,5.75 20.5,5.75 21.75,5.75 23,5.75 24.25,5.75 25.5,5.75 26.75,9.35 28.85,5.75 28.85,6.85
  pour GND (isolate 0.2, rank 2): 0,44.75 23.25,44.75 23.25,40 39,40 39,12.4 35.5,12.4 35.5,8.75 38,8.75 38,12.25 39,12.25 39,5.5 15.25,5.5 15.25,8 21.5,8 21.5,11 24.5,11 24.5,14.5 20.5,14.5 20.5,12.5 15.25,12.5 14.25,11.5 14.25,9 15,9 15,5.5 0,5.5
  pour Top: 37.25,13.25 38.5,13.25 38.5,7.75 36.5,7.75 36.5,8.75 38,8.75 38,12.5 37.25,12.5
  pour Top: 32.5,30.6 32.5,26.1 32.65,25.95 32.65,25.65 32.3,25.65 31.9,26.05 31.9,30 25.5,30 25.5,30.6
  pour Top (no thermals): 14.5,8 14.5,6.25 15.25,5.5 29.75,5.5 29.75,7.4 28.75,7.4 28.75,6 27.25,6 27.25,8
INT-ACCEL  (via drill 0.38)
  Top 0.152: v10.05,14.25 10.25,14.45 10.25,17.4 10.55,17.7 12.05,17.7 12.95,16.8 IC3.14
  Bottom 0.152: v10.05,14.25 10.05,12.25 9.65,11.85 8.05,11.85 7.5,11.3 7.5,10.75 K1.5
JRST-WIFI  (via drill 0.38)
  Top 0.152: IC12.7 27.68,17.57 v27.65,17.6 | v27.2,20.8 27,21 R21.2
  Bottom 0.152: v27.65,17.6 27.65,20.35 v27.2,20.8
JTCK/SWCLK-WIFI  (via drill 0.38)
  Top 0.152: IC12.10 28.38,15.62 28.25,15.5 26.6,15.5 v26.05,14.95
  Bottom 0.152: v26.05,14.95 25.7,14.6 23.25,14.6 22.75,15.1 22.75,16.2 22.4,16.55 19.9,16.55 18.35,18.1 18.35,19.05 18.65,19.35 19.1,19.35 19.47,19.72 K12.4
JTDI-WIFI  (via drill 0.38)
  Top 0.152: IC12.9 28.27,16.27 27.9,15.9 27,15.9 v26.85,16.05
  Bottom 0.152: v26.85,16.05 26.85,16.25 26.55,16.55 23.25,16.55 22.62,17.18 K12.8
JTDO-WIFI  (via drill 0.38)
  Top 0.152: IC12.8 28.02,16.93 v27.6,16.5
  Bottom 0.152: K12.6 22.55,18.45 23.2,17.8 26.45,17.8 27.6,16.65 v27.6,16.5
JTMS/SWDIO-WIFI  (via drill 0.38)
  Top 0.152: IC12.6 27.02,18.23 v26.95,18.25
  Bottom 0.152: v26.95,18.25 26.95,18.7 26.55,19.1 23.5,19.1 23.15,19.45 23.15,20.65 22.81,20.99 K12.2
LDO  (via drill 0.38)
  Top 0.152: IC7.8 10.6,10.35 11.25,11 R22.2 | R36.2 14.55,28.7 14.8,28.95 TP1.1
  Top 0.203: C19.1 19.7,11.3 | IC7.8 10.6,9.15 R25.2 C38.2 v11.75,8.35 | IC3.12 14.8,18.52 C23.2 14.45,19.2 v14.15,19.5 | C22.2 19.7,18.7 19.2,18.2 IC3.1 19.2,18.65 v19.15,18.7 | v10.45,22.75 10.47,22.73 IC10.14 11.78,22.73 12.15,22.35 C37.1 | R36.2 R31.2 12.2,28.7 v11.8,28.3 | 19.5,22 IC6.5 | 1.77,20.32 C53.2 1.48,20.23 1.05,20.65 | IC13.8 1.45,23.85 1.65,24.05 C54.1 1.65,25.1 v1.25,25.5 | IC13.2 1.05,20.65 | 1.05,20.65 1.2,20.55 v1.4,20.75
  Top 0.3: C44.2 C43.2 9.3,32.7 v8.7,33.3 8.25,32.85 IC1.24 | C45.2 C41.2 v9.25,40 9.25,39.25 IC1.36 | v2.25,40.75 IC1.48 2.75,41.45 3.1,41.8 C46.2 C42.2 | v1.25,39.75 IC1.1 1.75,39.25 2.75,40.25 | IC1.9 v2.5,35.25 | 19.75,22.1 19.75,22
  Top 0.4: 19.5,22.05 C47.1 | 19.5,22.05 IC6.5 19.05,22.05 | 19.5,22.05 19.7,22.05 19.75,22 | 19.5,22 19.53,22 v19.53,21.45 19.35,21.45 | 19.35,21.45 v18.88,21.45 | 19.35,21.45 19.35,22
  Top 0.5: v18.88,21.45 18.93,21.52 19.3,21.89
  Power 0.6: v20.25,12 20.25,12.75
  Bottom 0.152: K11.1 17.79,28.69 | K13.1 10.59,15.96 | 10.59,15.96 10.45,16.1 C27.2 | 10.59,15.96 v10.85,15.95
  Bottom 0.203: C28.2 17.79,27.65 17.79,28.69 18.08,28.4 v18.3,28.4 | K1.1 7.75,8.75 8.15,8.35 v11.75,8.35
  pour Top: 18.75,12.25 20.5,12.25 20.5,11.45 19.95,10.9 19.55,10.9 19.55,11.5 19.2,11.85 18.75,11.85
  pour Power (isolate 0.2, rank 4): 0,44.75 23.25,44.75 23.25,28.25 25.5,28.25 25.5,25.25 27.25,25.25 27.25,23 29.75,23 29.75,7.75 21.5,7.75 21.5,11 24.5,11 24.5,14.5 20.5,14.5 20.5,12.5 14.25,12.5 14.25,7.75 0,7.75
LED1
  Top 0.152: IC8.2 25.99,33.01 25.75,33.25 20.25,33.25 19.3,32.3 12.6,32.3 12.35,32.05 12.35,30.6 11.4,29.65 7.85,29.65 6.75,30.75 IC1.21
LED2
  Top 0.152: IC8.3 26.64,33.11 26.15,33.6 20,33.6 19.05,32.65 12.35,32.65 12,32.3 12,30.75 11.25,30 8.1,30 7.25,30.85 IC1.22
LED3
  Top 0.152: IC8.4 27.29,33.21 26.55,33.95 12.2,33.95 12,33.75 IC1.25
LED4
  Top 0.152: IC8.5 27.94,33.31 26.95,34.3 12.05,34.3 12,34.25 IC1.26
LED5
  Top 0.152: IC8.6 28.59,33.41 27.35,34.65 12,34.65 11.9,34.75 IC1.27
LED6
  Top 0.152: IC8.7 29.24,33.51 27.75,35 12.15,35 11.9,35.25 IC1.28
LED7
  Top 0.152: IC8.8 29.89,33.56 28.1,35.35 17.35,35.35 16.75,35.95 16.75,41.25 15.2,42.8 4.5,42.8 4.1,42.4 4.1,41.45 4.25,41.3 IC1.45
LED8
  Top 0.152: IC8.9 30.55,33.65 28.5,35.7 17.75,35.7 17.25,36.2 17.25,41.3 15.35,43.2 4.3,43.2 3.75,42.65 IC1.46
LED-GREEN  (via drill 0.38)
  Top 0.152: IC1.41 6.25,39.25 v6.5,39 | v33.33,37.88 33.33,37.67 33.77,37.23 R16.2 | v36.2,38.9 36.2,38.6 35.7,38.1 Q18.1
  Bottom 0.152: v6.5,39 6.5,38.25 7,37.75 33.2,37.75 v33.33,37.88 34.35,38.9 v36.2,38.9
LED-RED  (via drill 0.38)
  Top 0.152: IC1.40 6.75,40 v7.25,39.5 | Q11.1 33.7,39.7 33.1,39.1 33.1,39 v32.65,38.55 32.12,38.02 R15.2
  Bottom 0.152: v7.25,39.5 7.25,38.5 7.65,38.1 32.2,38.1 v32.65,38.55
MFI-EN
  Top 0.152: Q3.1 R6.2 12.9,15.1 13.6,14.4 IC3.20
MFI-RST
  Top 0.152: IC7.7 10.1,9.35 R25.1 9.75,8.05 10,7.8 13.5,7.8 13.85,8.15 13.85,11.4 14.2,11.75 14.75,11.75 14.8,11.8 IC3.25
MOTOR-AIN  (via drill 0.38)
  Top 0.152: IC1.30 9,36.25 7.5,37.75 5.25,37.75 4.85,38.15 v3.2,38.15 | v3.9,22 4.05,22.15 5.5,22.15 6.2,21.45 8.45,21.45 9.45,20.45 9.45,18.45 9.85,18.05 9.85,14.9 9.45,14.5 9.45,13.95 8,12.5 | 8,12.5 7.67,12.18 IC4.14 | IC4.13 7.78,11.53 8,11.75 8,12.5
  Bottom 0.152: v3.2,38.15 3,37.95 3,37 3.5,36.5 3.5,29.5 2.7,28.7 2.7,23.3 v3.9,22
MOTOR-BIN  (via drill 0.38)
  Top 0.152: IC1.31 9,36.75 7.4,38.35 5.15,38.35 4.75,38.75 v2.5,38.75 | IC4.7 2.08,12.18 1.75,12.5 | 1.75,12.5 1.15,13.1 1.15,17.05 3.5,19.4 3.5,21.15 v3.25,21.4 | IC4.8 1.98,11.53 1.75,11.75 1.75,12.5
  Bottom 0.152: v3.25,21.4 3.25,22.05 2.3,23 2.3,28.9 3.1,29.7 3.1,36.35 2.35,37.1 2.35,38.6 v2.5,38.75
MOTOR-CURRENT-SENS  (via drill 0.38)
  Top 0.152: IC4.1 6.03,14.5 | 3.9,15.6 4,15.5 4.03,15.47 | v2.55,34.15 2.45,34.25 IC1.11
  Top 0.4: 6.03,14.5 v6.75,14.5 | R4.1 3.9,15.6 | IC4.4 4.03,15.47 | 4,15.5 3.7,15.5 v3.7,15
  Bottom 0.152: v3.7,15 3.7,15.85 2.55,17 2.55,17.7 2.85,18 2.85,20.9 2.55,21.2 2.55,22.15 1.9,22.8 1.9,29 2.7,29.8 2.7,34 v2.55,34.15
  Bottom 0.4: v6.75,14.5 4.2,14.5 v3.7,15
MOTOR-EN  (via drill 0.38)
  Top 0.152: IC4.15 7.72,12.82 9.05,14.15 9.05,14.65 9.45,15.05 9.45,17.85 9.05,18.25 9.05,20.3 8.3,21.05 5.2,21.05 | 5.2,21.05 5.05,21.05 4.3,20.3 4.3,19.05 3.8,18.55 R24.2 | v5.25,21.55 5.2,21.5 5.2,21.05 | IC1.19 5.75,31.3 v6.1,30.95
  Bottom 0.152: v5.25,21.55 5.25,22.15 3.5,23.9 3.5,28.35 4.5,29.35 5,29.35 6.1,30.45 v6.1,30.95
MOTOR-OUT1
  Top 0.4: IC4.5 3.05,16.2 3.35,16.5 7.5,16.5 FB1.1 | IC4.16 7.58,13.47 8.4,14.3 FB1.1 | C29.1 FB1.1
MOTOR-OUT2
  Top 0.4: IC4.3 IC4.2 5.33,15.8 FB2.1 C29.2
MOTOR-VCP
  Top 0.3: IC4.9 4.03,10.12 3.6,9.7 C9.2
MOTOR-VINT
  Top 0.4: IC4.12 5.97,9.48 C8.2
N$1
  Top 0.203: IC3.39 20.6,13.6 20.75,13.75 20.75,14.5 21.4,15.15 C20.1
N$2
  Top 0.203: L2.1 17.25,10.5 L3.2 17.5,11.25 17.2,11.55 IC3.31
N$3
  Top 0.152: 27.48,7.28 L6.2
  Top 0.203: 27.48,7.28 C55.2 IC11.2
N$4
  Top 0.203: C4.1 L2.2 18.1,9.9 18.1,11.2 17.6,11.7 IC3.32
N$5
  Top 0.203: C5.1 L1.1 C4.2
N$6  (via drill 0.38)
  Top 0.4: v37.5,29 FB4.2
  Bottom 0.4: v37.5,29 37.5,27.5 38.25,26.75 38.25,16.75 37.5,16 35.5,16 35,15.5 35,13.5 34.5,13 34.5,11.5 35.08,10.93 K10.2
N$7
  Top 0.5: C31.1 7.6,20.5 8.1,20 K8.P$1 8.15,19.97 C30.2 8.15,17.25 FB1.2
N$8
  Top 0.152: IC12.27 36.5,15.62 R2.2
N$9
  Top 0.4: IC12.24 36.23,13.68 36.45,13.45 36.45,11.55 36.6,11.4 L4.1
N$10
  Top 0.203: IC8.18 26.61,38.54 26.35,38.8 26.02,38.8 R7.2
N$11
  Top 0.203: C21.1 15.75,11.05 16.4,11.7 IC3.29
N$12
  Top 0.5: 5.15,19.5 C32.1 5.15,17.25 FB2.2 | 5.15,19.5 5.15,19.95 K9.P$1 | C31.2 5.15,19.5
N$13
  Top 0.203: IC8.15 28.53,39.3 R10.2
N$14
  Top 0.152: IC12.35 36.58,20.82 36.75,21 R1.2
N$15  (via drill 0.38)
  Top 0.4: v34.5,29 FB3.2
  Bottom 0.4: v34.5,29 34.5,27.5 33.6,26.6 33.6,23.1 34.65,22.05 34.65,19.95 33.5,18.8 33.5,11.25 33.83,10.93 K10.1
N$16
  Top 0.203: IC8.17 27.25,38.58 R8.2
N$17
  Top 0.3: IC2.5 35.02,31.89 FB3.1
N$18
  Top 0.3: IC2.8 36.98,31.89 FB4.1
N$19  (via drill 0.38)
  Top 0.152: 20.55,42.75 R5.2 19.3,42.8 19,42.5 19,39.25 v18.75,39 | IC5.3 14.12,38.12 v14.65,38.65
  Bottom 0.152: v14.65,38.65 18.4,38.65 v18.75,39
N$20
  Top 0.152: 27.48,6.42 L7.2
  Top 0.203: 27.48,6.42 C55.1 ANT1.ANT
N$21
  Top 0.203: IC7.1 10.6,12.35 10.9,12.65 Q3.3
N$22
  Top 0.152: IC2.3 35.67,36.12 35.25,36.55 34.25,36.55 34.1,36.4 33,36.4 32.5,35.9 32.5,32.15 31.75,31.4 13.65,31.4 11.5,29.25 7.65,29.25 6.95,29.95 4.85,29.95 4.4,29.5 R30.2
N$23
  Top 0.152: IC2.4 35.02,35.92 35,36.2 34.45,36.2 34.25,36 33.2,36 32.9,35.7 32.9,32.05 31.9,31.05 13.8,31.05 11.6,28.85 7.5,28.85 6.8,29.55 5.05,29.55 4.65,29.15 4.2,29.15 3.9,28.85 1.9,28.85 1.75,29 R32.2
N$24
  Top 0.152: TP5.1 11,35.75 IC1.29
N$25
  Top 0.203: IC8.13 29.83,38.66 R12.2
N$26
  Top 0.5: K3.10 35.94,40.31 37,39.25 Q18.3
N$27
  Top 0.152: C34.2 R30.1
N$28
  Top 0.152: C16.1 R32.1
N$29
  Top 0.5: Q11.3 34.67,39.73 K3.9
N$30
  Top 0.203: K3.1 24.51,41.16 R7.1
N$31
  Top 0.203: K3.2 25.78,40.89 R8.1
N$32
  Top 0.203: K3.3 27.05,40.62 R9.1
N$33
  Top 0.203: K3.4 28.32,40.35 R10.1
N$34
  Top 0.203: K3.5 29.59,40.27 R11.1
N$35
  Top 0.203: K3.6 30.86,40.54 R12.1
N$36
  Top 0.203: K3.7 32.13,40.81 R13.1
N$37
  Top 0.203: K3.8 33.4,41.08 R14.1
N$38
  Top 0.203: IC8.16 27.88,38.95 R9.2
N$39
  Top 0.152: R19.1 Q6.1 7.6,25.3 Q4.3
N$40
  Top 0.203: IC8.14 29.18,39.01 R11.2
N$41
  Top 0.152: Q6.3 6.55,23.25 R17.2
N$42
  Top 0.203: IC8.12 30.48,38.68 30.6,38.8 30.98,38.8 R13.2
N$43
  Top 0.203: IC8.11 31.13,38.38 31.5,38.75 31.93,38.75 R14.2
N$44
  Top 0.203: C6.1 L3.1 16.5,11.25 16.8,11.55 IC3.30
N$45
  Bottom 0.8: K7.1 6.47,25.88 7.25,25.1 10.65,25.1 11.2,24.55 26.7,24.55 28,23.25 28.75,23.25 30.38,21.62 K6.2
N$46
  Top 0.152: Q9.1 4.1,25.85 3.25,25 R26.2
N$49
  Top 0.3: IC9.9 29.5,25 29.25,25.25 29.25,26.25 30.25,27.25 30.25,27.85 L5.1
N$50
  Top 0.4: IC12.22 34.27,11.03 C36.2 34.25,10.75 35.4,9.6 L4.2
N$51
  Top 0.203: IC13.4 1.85,21.3 2.55,20.6 C35.2
N$52
  Top 0.203: IC13.1 0.65,19.73 C52.2
NONO-ZONE
  cutout GND: 26.25,30 31.9,30 31.9,26.25 26.25,26.25
  cutout Power: 26.5,29.75 31.65,29.75 31.65,26.25 26.5,26.25
NRST-COP  (via drill 0.38)
  Top 0.152: v6.45,35.55 5.75,36.25 3.2,36.25 2.75,36.7 2.3,36.7 1.85,36.25 IC1.7
  Bottom 0.152: K11.10 12.71,34.84 12.35,35.2 7.5,35.2 7.3,35.4 6.6,35.4 v6.45,35.55
NRST-WIFI  (via drill 0.38)
  Top 0.152: IC12.2 28.38,20.82 v27.7,21.5
  Bottom 0.152: K12.10 21.39,15.91 23.15,14.15 26.45,14.15 26.8,14.5 26.8,15.1 27.4,15.7 27.85,15.7 28.4,16.25 28.4,17.85 28.02,18.23 28.02,21.18 v27.7,21.5
SCL-LDO  (via drill 0.38)
  Top 0.152: IC1.42 5.75,39.15 v5.5,38.9 | 9.6,9.75 IC7.6 9.6,10.4 9.5,10.5 9,10.5 | 9,10.5 8.9,10.6 8.9,11.35 9.15,11.6 11.25,11.6 11.4,11.75 12,11.75 12.5,12.25 v12.5,12.75 13.35,13.6 IC3.22 | IC10.3 16.9,24 16,24 15,23 14.45,23 v14,23.45 14,24.5 14.5,25 v14.5,25.65 | R36.1 14.05,27.7 v14.5,27.25 15.05,27.25 15.7,27.9 TP2.1 | v10,20.75 10,21 8.75,22.25 6.15,22.25 5.85,22.55 5.85,23.4 5.5,23.75 2.9,23.75 2.55,24.1 2.2,24.1 1.85,23.75 IC13.7 | 9,10.5 8.25,9.7 v8.25,9.25
  Bottom 0.152: v5.5,38.9 5.5,38.15 5.65,38 5.65,36.25 5.1,35.7 5.1,32.25 5.4,31.95 9.45,31.95 10.75,30.65 10.75,28 11.05,27.7 14.05,27.7 v14.5,27.25 v14.5,25.65 | v12.5,12.75 12.7,12.75 13.7,13.75 13.7,14.45 12.85,15.3 9.95,15.3 9.5,15.75 9.5,20.75 | 9.5,20.75 9.5,21.35 9.9,21.75 13,21.75 14,22.75 v14,23.45 | 9.5,20.75 v10,20.75 | K1.2 v8.25,9.25
SCL-SMPS  (via drill 0.38)
  Top 0.152: IC12.48 30.52,18.23 v30.55,18.24 | IC10.4 15.12,24.68 14.85,24.4 v14.85,23.7
  Bottom 0.152: v14.85,23.7 15.6,23.7 15.75,23.85 16.45,23.85 16.6,23.7 22.2,23.7 22.9,23 27.15,23 27.7,22.45 28.5,22.45 30.1,20.85 30.1,18.45 30.31,18.24 v30.55,18.24
SDA-LDO  (via drill 0.38)
  Top 0.152: IC1.43 5.25,39.9 v5,39.65 | IC7.2 10.1,12.85 | 10.1,12.85 10.6,13.35 12.65,13.35 13.07,13.77 | 10.1,12.85 8.95,12.85 8.5,12.4 8.5,10.9 v8.15,10.55 | 13.07,13.77 13.3,14 IC3.21 | 13.07,13.77 13.07,14.07 v13.05,14.1 | IC10.1 16.62,22.73 16.4,22.5 14.4,22.5 14.15,22.75 13.35,22.75 v13.15,22.95 13.05,23.05 v13.05,25.65 | R31.1 12.75,27.65 13.05,27.35 v13.05,27 13.4,26.65 15.25,26.65 16.6,28 TP3.1 | IC13.6 2.25,22.9 2.4,22.75 4.75,22.75 v5.15,23.15
  Bottom 0.152: v5,39.65 4.8,39.45 4.8,38.15 5.25,37.7 5.25,36.65 4.7,36.1 4.7,32 5.2,31.5 9.25,31.5 10.25,30.5 10.25,27.65 10.6,27.3 12.85,27.3 13.05,27.1 v13.05,27 v13.05,25.65 | v13.05,14.1 13.05,14.35 12.5,14.9 9.7,14.9 9.1,15.5 9.1,21.5 | 9.1,21.5 9.7,22.1 12.65,22.1 13.15,22.6 v13.15,22.95 | 9.1,21.5 6.5,21.5 5.15,22.85 v5.15,23.15 | K1.4 8.45,10.25 v8.15,10.55
SDA-SMPS  (via drill 0.38)
  Top 0.152: IC12.49 30.35,17.57 30.75,17.18 30.75,14.53 v30.5,14.28 | v16.05,23.2 16.23,23.38 IC10.2
  Bottom 0.152: v16.05,23.2 16.15,23.3 21.95,23.3 22.6,22.65 26.95,22.65 27.5,22.1 28.3,22.1 29.75,20.65 29.75,18.1 30.5,17.35 v30.5,14.28
SMPS  (via drill 0.38)
  Top 0.152: R5.1 C39.2 | R27.2 33.92,8 Q10.2
  Top 0.2: 21.55,40.66 23.42,40.66 v24.25,39.83
  Top 0.3: IC9.5 28.5,23.5 28.75,23.75 28.75,26.25 27.75,27.25 27.75,27.85 L5.2 27.6,28.75 | IC2.6 35.67,31.43 C33.2
  Top 0.4: v32.95,7.32 v32.95,8 33.15,8.2 Q10.2 | C33.2 35.5,30.25 | C51.1 35.5,30.15 35.5,30.25 | IC8.20 25.34,38.25 C40.1 v24.25,39 v24.25,39.83 | C39.2 21.55,40.66 IC5.8 | 35.5,30.25 v35.73,30.25 v36.4,30.25 36.4,29.75 | v25.75,28.65 26.3,28.65 C49.1
  Top 0.6: 27.6,28.75 C49.1 26.4,28.6 | v25.75,27.95 v25.75,28.65 v25.75,29.35
  pour Power (isolate 0.2, rank 2): 39,40 23.75,40 23.75,28.5 25.5,28.5 25.5,25.5 27.75,25.5 27.75,23.5 30.25,23.5 30.25,7.75 39,7.75 39,8.75 35.5,8.75 35.5,12.25 39,12.25
SMPS-EN
  Top 0.152: Q5.1 R29.2 18.55,27.75 18.3,27.5 18.3,26.1 18.45,25.95 18.45,25.3 19,24.75 20,24.75 20.35,24.4 20.35,21.15 20.1,20.9 18.5,20.9 18,20.4 IC3.4
SMPS-IN
  Top 0.152: C50.1 24.9,26.15 24,25.25 24,23.25 24.25,23 29,23 29.25,23.25 29.25,24.25 29.5,24.5 IC9.8
  Top 0.3: C50.1 25.65,25.5 IC9.1
  Top 0.4: Q8.3 23.97,27.18 C50.1
SMPS-WIFI  (via drill 0.38)
  Top 0.152: R21.1 23.95,21 v23.75,21.2
  Top 0.4: IC12.15 29.73,11.5 | 28.2,11.2 28.2,9.3 28.5,9 C11.1 30.5,9 31.18,8.32 31.18,7.85 Q10.3 | 28.2,11.2 28.5,11.5 C10.1 29.73,11.5 | 28.2,11.2 28.2,11.55 v28,11.75 | IC12.18 31.68,12.03 32,11.7 | 32,11.7 C12.1 | IC12.19 32.33,12.03 32,11.7 | IC12.20 32.98,12.03 33.3,11.7 | IC12.21 33.62,12.03 33.3,11.7 | 33.3,11.7 33.3,11.05 C14.1 C12.1 | C12.1 31.25,11.5 C13.1 C15.1 29.73,11.5
  Power 0.4: v28,11.75 29,11.75 29.5,12.25 29.5,19.5 29,20 24.95,20 v23.75,21.2
  Bottom 0.152: v23.75,21.2 23.75,21 K12.1 | R21.1 K12.1 | K12.1 24.33,20.99
  Bottom 0.2: C26.2 22.21,22.34 23.35,21.2 v23.75,21.2
SWCLK-BLE  (via drill 0.38)
  Top 0.152: R23.1 13.25,10 13.5,10.25 13.5,11.9 v13.75,12.15 13.75,12.75 13.8,12.8 IC3.24
  Bottom 0.152: K13.4 17.27,17.23 17.5,17 17.5,15.5 17.25,15.25 14.85,15.25 14.6,15 14.6,13 v13.75,12.15
SWCLK-COP  (via drill 0.38)
  Top 0.152: IC1.37 8.25,41.5 v8.5,41.75 | v15.25,35.75 15.7,36.2 15.7,38.55 15,39.25 15,41.65 v14.7,41.95
  Bottom 0.152: v8.5,41.75 8.8,42.05 14.6,42.05 v14.7,41.95 | v15.25,35.75 16,35 16.25,35 16.52,34.73 K11.4
SWDIO-BLE  (via drill 0.38)
  Top 0.152: IC3.23 13.65,13.2 13.05,12.6 13.05,11.95 v12.75,11.65 R22.1
  Bottom 0.152: K13.2 14.46,15.96 14.25,15.75 14.25,13.65 13.15,12.55 13.15,12.05 v12.75,11.65
SWDIO-COP  (via drill 0.38)
  Top 0.152: IC1.34 10.5,38.25 v11,38.75 | v16.15,35.75 16.25,35.85 16.25,39.1 v16,39.35
  Bottom 0.152: K11.2 17.79,35.21 17.25,35.75 v16.15,35.75 | v16,39.35 14.35,39.35 13.75,38.75 v11,38.75
UART-RX-DEBUG-1BD
  Top 0.152: IC12.28 36.02,16.27 36.25,16.5 37.4,16.5 37.9,17 37.9,25.6 K2.1
UART-RX-DEBUG-BLE  (via drill 0.38)
  Top 0.152: v15,20 15.2,19.8 IC3.11
  Bottom 0.152: K13.8 14.97,19.77 v15,20
UART-RX-DEBUG-COP  (via drill 0.38)
  Top 0.152: IC1.13 2.72,33.02 3.1,33.4 5.8,33.4 v6.45,34
  Bottom 0.152: K11.8 13.98,32.08 13.75,31.85 12.2,31.85 11.55,32.5 10.15,32.5 9.9,32.75 6.7,32.75 6.45,33 v6.45,34
UART-TX-DEBUG-1BD
  Top 0.152: IC12.29 37.17,16.93 37.5,17.25 37.5,24.73 K2.2
UART-TX-DEBUG-BLE  (via drill 0.38)
  Top 0.152: IC3.10 15.6,18.45 v15.95,18.8
  Bottom 0.152: v15.95,18.8 K13.6
UART-TX-DEBUG-COP  (via drill 0.38)
  Top 0.152: IC1.12 1.9,33.75 2.15,33.5 2.65,33.5 2.9,33.75 5.05,33.75 v5.65,34.35
  Bottom 0.152: K11.6 15.25,31.85 14.9,31.5 11.95,31.5 11.4,32.05 9.95,32.05 9.65,32.35 5.85,32.35 5.6,32.6 v5.65,34.35
VBAT  (via drill 0.38)
  Top 0.152: R28.2 22.8,29.05 22.8,26.3 | Q6.2 R19.2 6,26.82 D1.2 | R35.2 7.43,3.9 Q7.2
  Top 0.3: Q9.3 6.27,26.8 D1.2
  Top 0.4: Q8.2 22.8,26.3 22.93,26.3 v23.1,26.13 v23.1,25.45 22.65,25 21.4,25 20.9,24.5 20.9,22.45 21.3,22.05 IC6.1 23.2,22.05 C48.1 | 6.27,26.8 6.45,26.8 | v7.15,27.9 v7.15,27.25 v7.15,26.6 6.65,26.6 6.45,26.8 | 6.45,26.8 6.8,26.8 7,27 | Q7.2 5.83,4.78 5.6,4.55 5.6,4 5.3,3.7 1.55,3.7 v1,4.25 v1,4.9 v1,5.55 | v0.7,28.55 v0.7,27.9 v0.7,27.25 1.5,27.25 1.95,26.8 Q9.3
  Bottom 0.4: v1,4.25 v1,5.55 0.5,6.05 0.5,27.05 v0.7,27.25 v0.7,28.55
  pour Power (rank 3): 7.5,25.25 7,25.75 7,26.1 7.6,26.7 7.6,28.15 6.6,28.15 6.6,27 5.75,26.15 5.75,24.75 6.5,24 23.5,24 23.5,26.5 22.5,26.5 22.5,25.25
VBAT-RAW  (via drill 0.38)
  Top 0.4: Q9.2 4.22,28.12 v4.5,28.45 | v5.15,28.45 5.15,28.09 | 5.15,28.09 v5.15,27.8 5.1,27.75 4.25,27.75 | 5.15,28.09 5.06,28 4.5,28
  Top 0.5: v4.5,28.45 v5.15,28.45
  Bottom 0.4: K7.2 4.88,27.12 4.5,27.5 v4.5,28.45
VMOTOR
  Top 0.4: IC4.10 4.67,9.28 C9.1 4.6,7.78 4.4,7.78 C7.2 4.32,7.38 4.98,6.72 Q7.3
VMOTOR-ENABLE
  Top 0.152: R37.2 Q12.1
WIFI-SELF-POWER  (via drill 0.38)
  Top 0.152: R34.2 Q1.1 20.5,30 v21,30.5 | v33.95,5.4 34.1,5.55 Q2.1 | IC12.47 30.32,18.88 30.75,19.3 30.75,20.55 v30.85,20.65
  Bottom 0.152: 32.25,18.35 32.25,14.05 32.85,13.45 32.85,9.45 33.2,9.1 35.7,9.1 36,8.8 36,7.4 34,5.4 v33.95,5.4 | v21,30.5 22.5,30.5 23.25,31.25 32.5,31.25 33,30.75 33,22.95 34,21.95 34,20.1 32.25,18.35 | 32.25,18.35 32.25,18.5 30.75,20 30.75,20.55 v30.85,20.65

## Text on the board
tPlace: ... | MCO | 3V3 | SCL | SDA | GND | GND | TXD | RXD | WKUP
bPlace: 1 | 10 | RX | TX | STM32L0 | + | nRF51x22 | STM32F4 | RX | TX | - | INT | SCL | SDA | GND | 3v3